# EAGLE design motherboard (EAGLE 7.2.0)
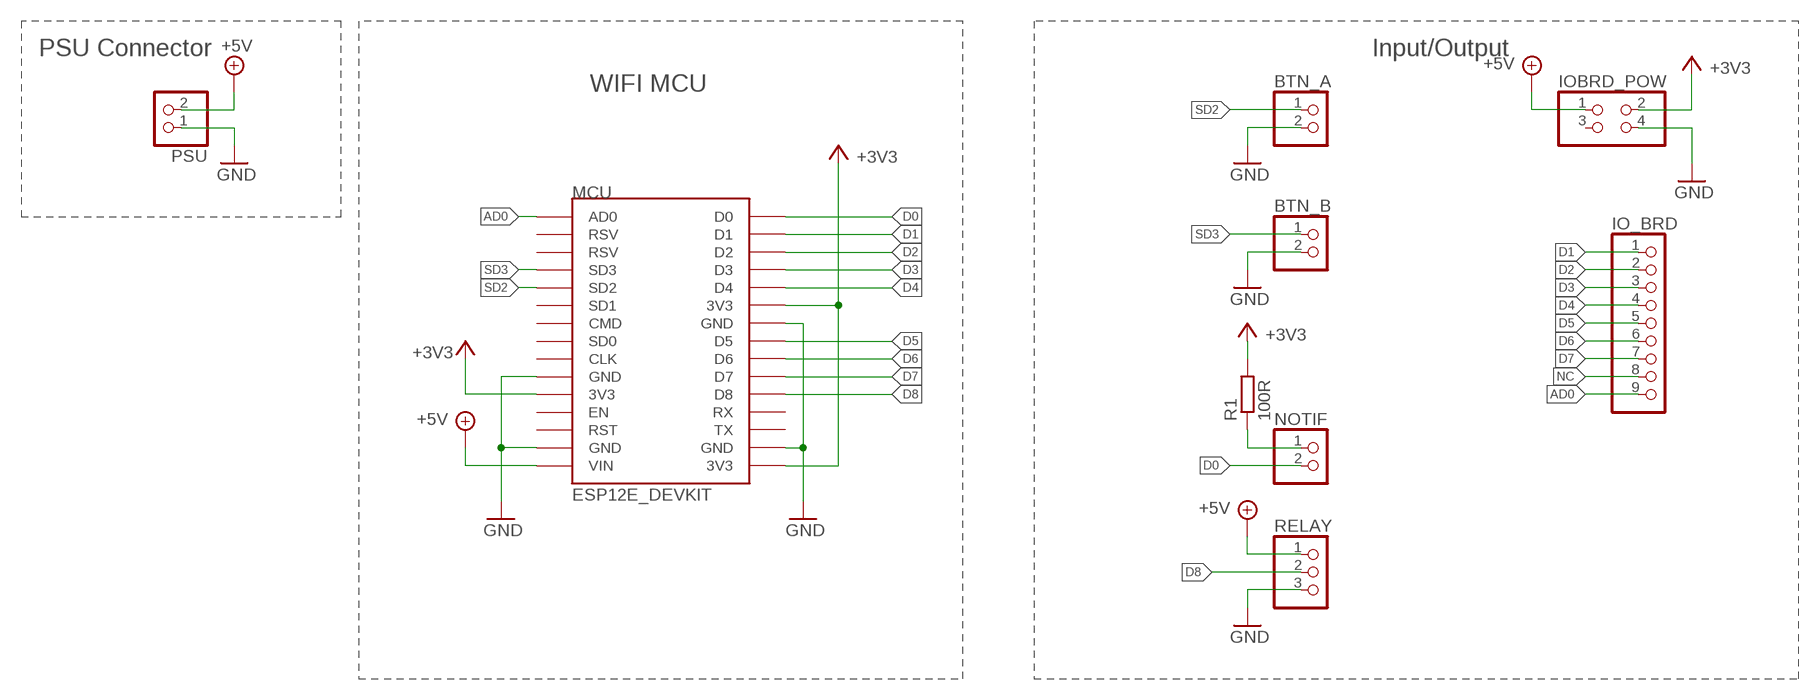
[diagram p0: schematic, sheet 1]

## Parts
BTN_A  PINHD-1X2  [1X02]
BTN_B  PINHD-1X2  [1X02]
IO_BRD  PINHD-1X9  [1X09]
IOBRD_POW  PINHD-2X2  [2X02]
MCU  ESP12E_DEVKIT  [ESP12E_DEVKIT]
NOTIF  PINHD-1X2  [1X02]
PSU  PINHD-1X2  [1X02]
R1  100R  R-EU_0204/7  [0204/7]
RELAY  PINHD-1X3  [1X03]

## Nets
+3V3: IOBRD_POW.2 MCU.3V3@0(3V3) MCU.3V3@1(3V3) MCU.3V3@2(3V3) R1.2
+5V: IOBRD_POW.1 MCU.VIN PSU.2 RELAY.1
AD0: IO_BRD.9 MCU.AD0
D0: MCU.D0 NOTIF.2
D1: IO_BRD.1 MCU.D1
D2: IO_BRD.2 MCU.D2
D3: IO_BRD.3 MCU.D3
D4: IO_BRD.4 MCU.D4
D5: IO_BRD.5 MCU.D5
D6: IO_BRD.6 MCU.D6
D7: IO_BRD.7 MCU.D7
D8: MCU.D8 RELAY.2
GND: BTN_A.2 BTN_B.2 IOBRD_POW.4 MCU.GND@0(GND) MCU.GND@1(GND) MCU.GND@2(GND) MCU.GND@3(GND) PSU.1 RELAY.3
N$1: NOTIF.1 R1.1
NC: IO_BRD.8
SD2: BTN_A.1 MCU.SD2
SD3: BTN_B.1 MCU.SD3
Unconnected: IOBRD_POW.3 MCU.CLK MCU.CMD MCU.EN MCU.RST MCU.RSV@0(RSV) MCU.RSV@1(RSV) MCU.RX MCU.SD0 MCU.SD1 MCU.TX

## Notes on the sheet
- PSU Connector | Input/Output
- WIFI MCU

## Library data of the parts
BTN_A BTN_B NOTIF PSU = pinhead:PINHD-1X2: PIN HEADER
IO_BRD = pinhead:PINHD-1X9: PIN HEADER
IOBRD_POW = pinhead:PINHD-2X2: PIN HEADER
MCU = ESP12E_DEVKIT:ESP12E_DEVKIT: ESP12E DEVKIT BOARD
R1 = rcl:R-EU_: RESISTOR, European symbol
RELAY = pinhead:PINHD-1X3: PIN HEADER

## Board
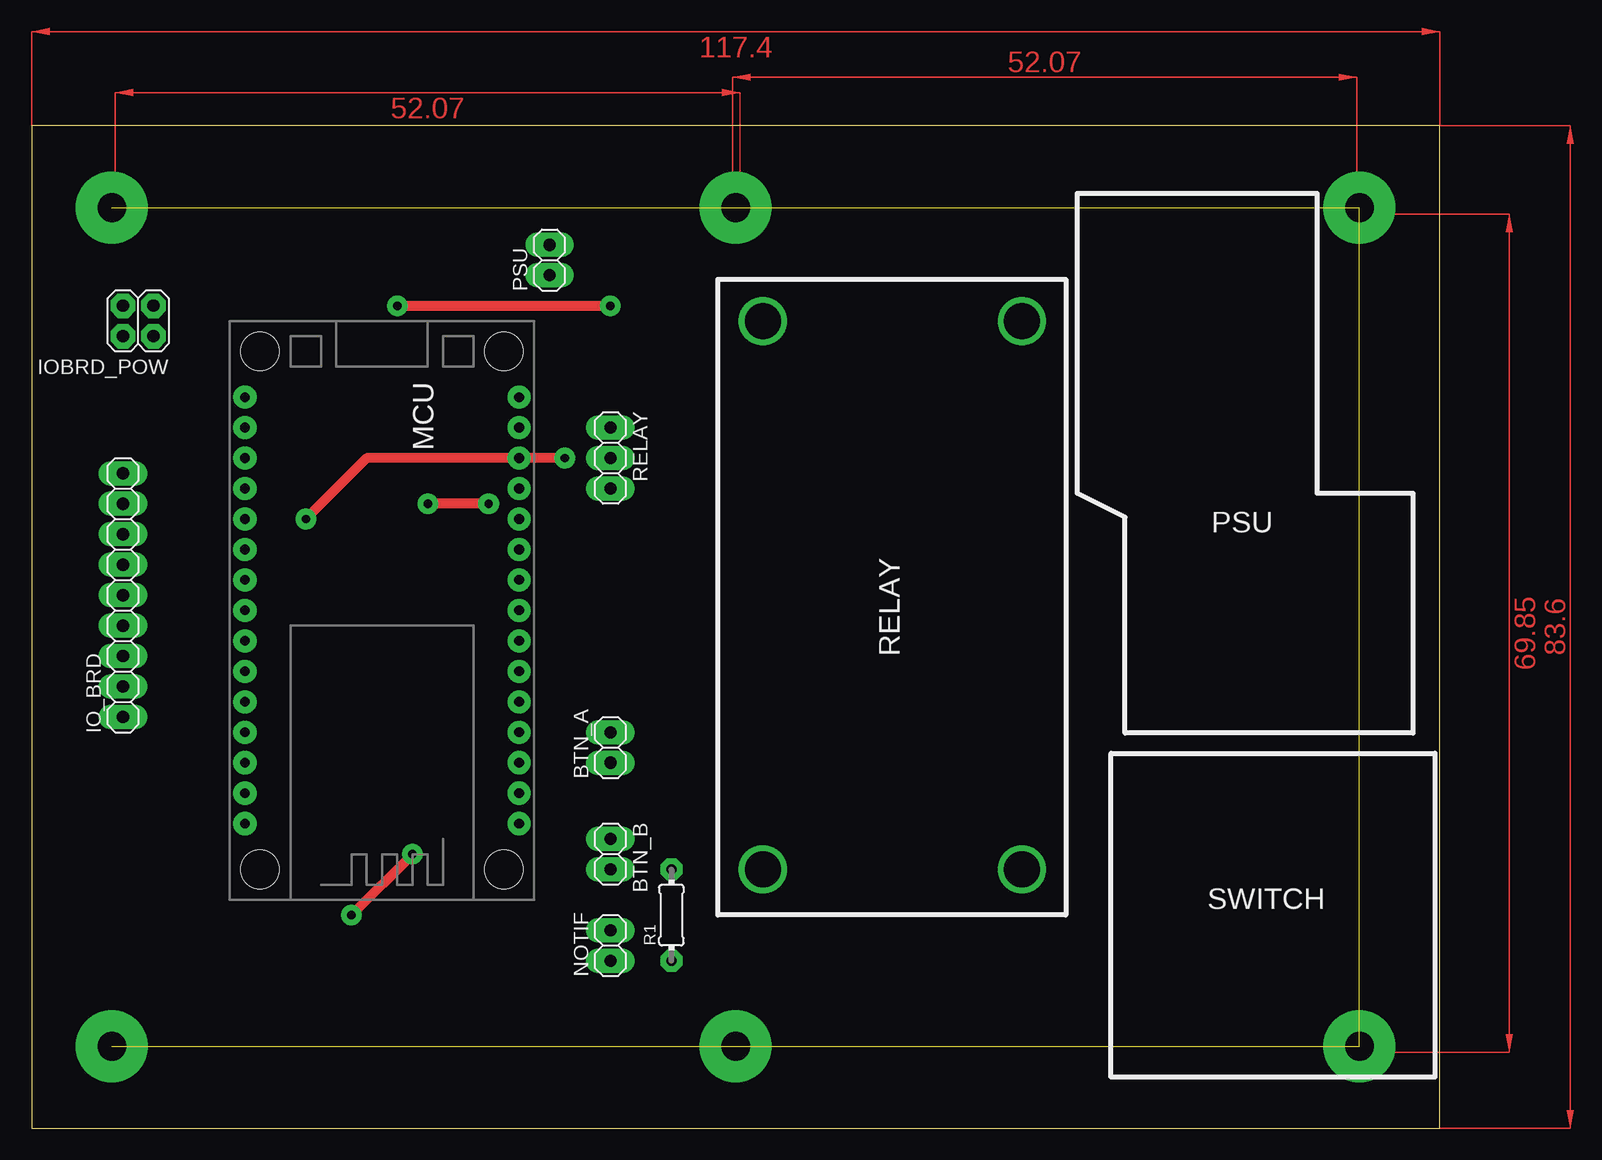
[diagram p1: board, top side]
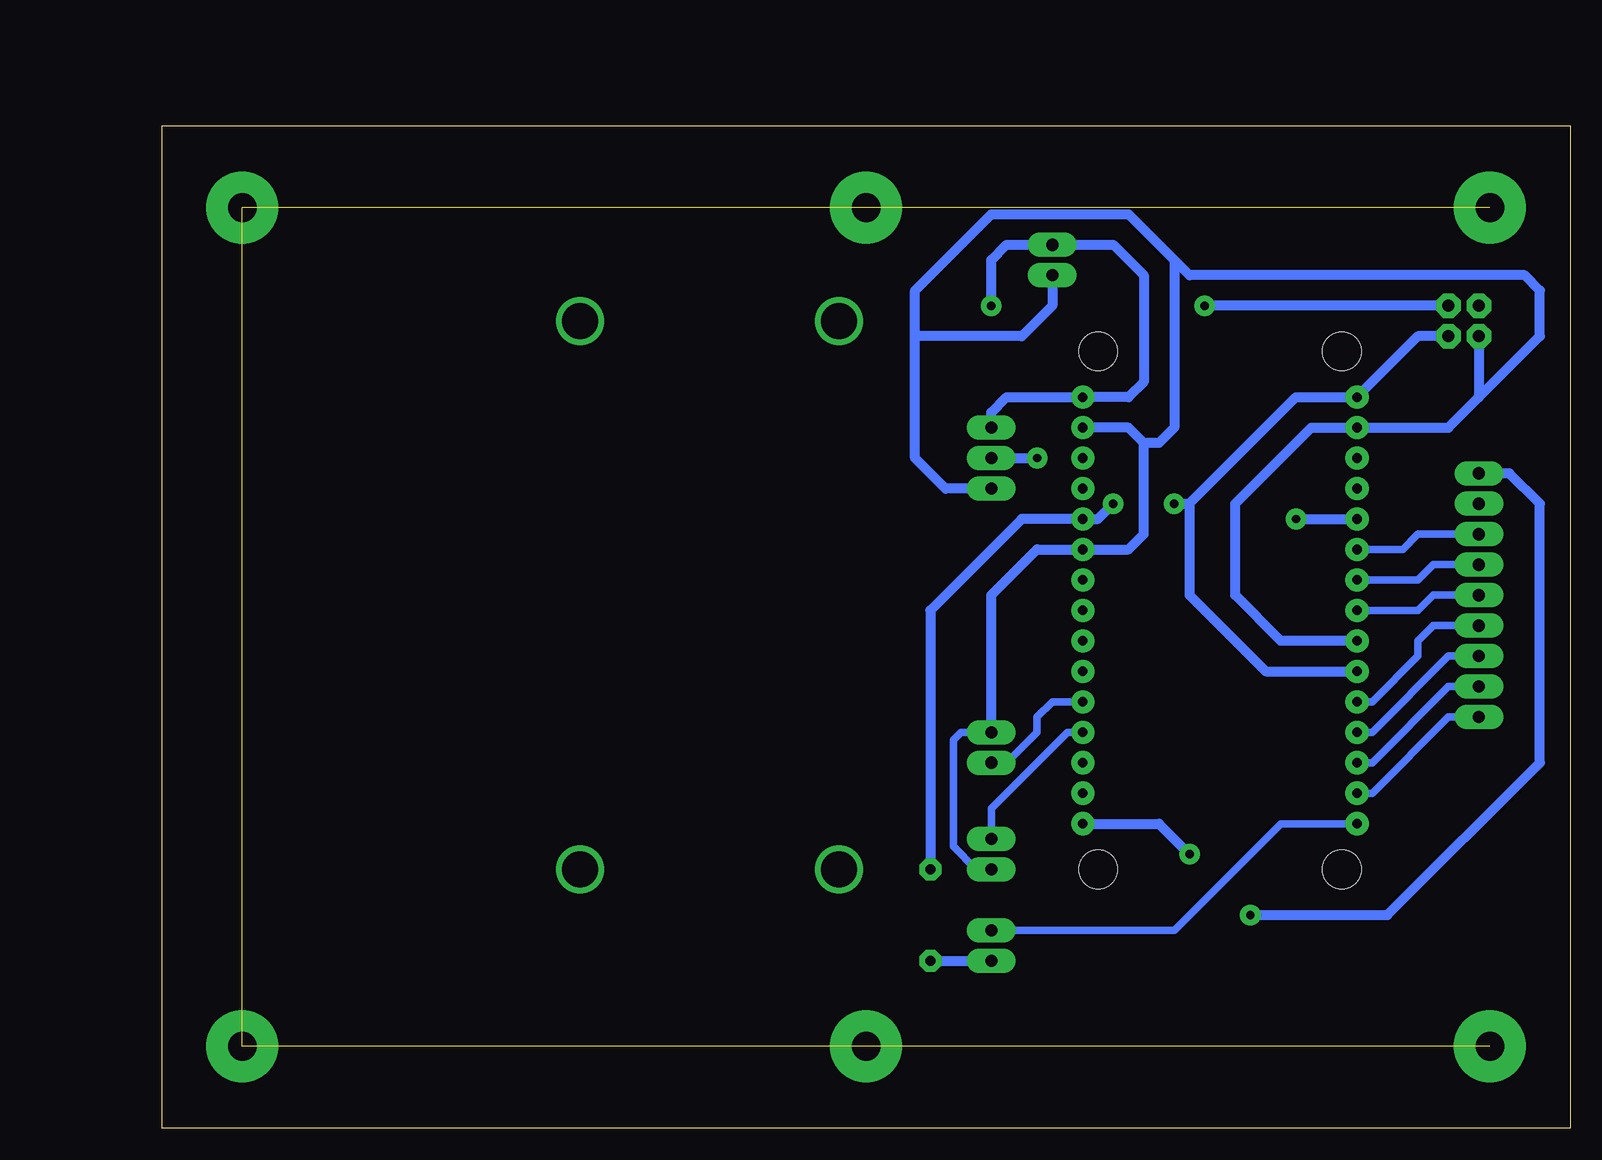
[diagram p2: board, bottom side, seen from below]

Size 117.4 x 83.6 mm. Coordinates in mm from the lower left corner, seen from the top.
Outline: 0,0 117.4,0 117.4,83.6 0,83.6 0,0
Copper layers (1*16): Top 0.035mm / dielectric 1.5mm / Bottom 0.035mm
Design rules "default *": minimum track width 10mil, minimum drill 24mil, track to track 8mil, track to pad 8mil, pad to pad 8mil, via to via 8mil, smd to smd 8mil, copper to edge 40mil, drill to drill 8mil, minimum pad ring 20mil, minimum via ring 20mil, stop-mask expansion 4mil, vias tented up to drill 0mil, thermal gap 10mil

### Footprints (pad centres in the part's own frame; a part is rotated, then mirrored left to right if it is on the bottom)
1X02 = drill 1.016 long: 1 -1.27,0; 2 1.27,0
1X09 = drill 1.016 long: 1 -10.16,0; 2 -7.62,0; 3 -5.08,0; 4 -2.54,0; 5 0,0; 6 2.54,0; 7 5.08,0; 8 7.62,0; 9 10.16,0
2X02 = drill 1.016 octagon: 1 -1.27,-1.27; 2 -1.27,1.27; 3 1.27,-1.27; 4 1.27,1.27
ESP12E_DEVKIT = drill 0.8 pad 1.93: 3V3@0 -11.43,-7.62; 3V3@1 11.43,5.08; 3V3@2 11.43,-17.78; AD0 -11.43,17.78; CLK -11.43,-2.54; CMD -11.43,2.54; D0 11.43,17.78; D1 11.43,15.24; D2 11.43,12.7; D3 11.43,10.16; D4 11.43,7.62; D5 11.43,0; D6 11.43,-2.54; D7 11.43,-5.08; D8 11.43,-7.62; EN -11.43,-10.16; GND@0 -11.43,-5.08; GND@1 -11.43,-15.24; GND@2 11.43,2.54; GND@3 11.43,-15.24; RST -11.43,-12.7; RSV@0 -11.43,15.24; RSV@1 -11.43,12.7; RX 11.43,-10.16; SD0 -11.43,0; SD1 -11.43,5.08; SD2 -11.43,7.62; SD3 -11.43,10.16; TX 11.43,-12.7; VIN -11.43,-17.78 | hole 3.2: -10.16,21.59; 10.16,21.59; 10.16,-21.59; -10.16,-21.59
0204/7 = drill 0.813 octagon: 1 -3.81,0; 2 3.81,0
1X03 = drill 1.016 long: 1 -2.54,0; 2 0,0; 3 2.54,0

### Placement (x,y rotation side)
BTN_A  48.26,31.75 90 top
BTN_B  48.26,22.86 270 top
IO_BRD  7.62,44.45 90 top
IOBRD_POW  8.89,67.31 180 top
MCU  29.21,43.18 180 top
NOTIF  48.26,15.24 90 top
PSU  43.18,72.39 90 top
R1  53.34,17.78 90 top
RELAY  48.26,55.88 270 top

### Tracks (layer width: path | path; a pad name or v marks a point on that pad's centre or on a via)
+3V3  (via drill 0.7)
  Top 0.813: v38.1,52.07 v33.02,52.07
  Bottom 0.813: IOBRD_POW.2 12.7,66.04 MCU.3V3@2 22.86,60.96 31.75,52.07 | v38.1,52.07 39.37,50.8 MCU.3V3@0 45.72,50.8 53.34,43.18 R1.2 | v33.02,52.07 31.75,52.07 | 31.75,52.07 31.75,44.45 25.4,38.1 MCU.3V3@1
+5V  (via drill 0.7)
  Top 0.813: v30.48,68.58 v48.26,68.58
  Bottom 0.813: RELAY.1 48.26,59.69 46.99,60.96 MCU.VIN 36.83,60.96 35.56,62.23 35.56,71.12 38.1,73.66 PSU.2 46.99,73.66 48.26,72.39 v48.26,68.58 | IOBRD_POW.1 v30.48,68.58
AD0  (via drill 0.7)
  Top 0.813: v31.75,22.86 v26.67,17.78
  Bottom 0.813: MCU.AD0 34.29,25.4 v31.75,22.86 | v26.67,17.78 15.24,17.78 2.54,30.48 2.54,52.07 5.08,54.61 IO_BRD.9
D0
  Bottom 0.61: NOTIF.2 33.02,16.51 24.13,25.4 MCU.D0
D1
  Bottom 0.61: MCU.D1 16.51,27.94 10.16,34.29 IO_BRD.1
D2
  Bottom 0.61: IO_BRD.2 10.16,36.83 16.51,30.48 MCU.D2
D3
  Bottom 0.61: MCU.D3 16.51,33.02 10.16,39.37 IO_BRD.3
D4
  Bottom 0.61: MCU.D4 16.51,35.56 12.7,39.37 12.7,40.64 11.43,41.91 IO_BRD.4
D5
  Bottom 0.61: MCU.D5 12.7,43.18 11.43,44.45 IO_BRD.5
D6
  Bottom 0.61: MCU.D6 12.7,45.72 11.43,46.99 IO_BRD.6
D7
  Bottom 0.61: MCU.D7 13.97,48.26 12.7,49.53 IO_BRD.7
D8  (via drill 0.7)
  Top 0.813: v44.45,55.88 27.94,55.88 v22.86,50.8
  Bottom 0.813: RELAY.2 v44.45,55.88 | v22.86,50.8 MCU.D8
GND
  Bottom 0.61: BTN_B.2 49.53,21.59 51.44,23.5 51.44,32.38 50.8,33.02 BTN_A.2
  Bottom 0.813: 35.56,57.15 35.56,49.53 36.83,48.26 MCU.GND@0 44.45,48.26 48.26,44.45 BTN_A.2 | 35.56,57.15 36.83,58.42 MCU.GND@1 | RELAY.3 52.07,53.34 54.61,55.88 54.61,66.04 | 54.61,66.04 54.61,69.85 48.26,76.2 36.83,76.2 33.02,72.39 | 33.02,72.39 33.02,58.42 34.29,57.15 35.56,57.15 | PSU.1 43.18,68.58 45.72,66.04 54.61,66.04 | IOBRD_POW.4 7.62,60.96 | 7.62,60.96 10.16,58.42 MCU.GND@3 21.59,58.42 27.94,52.07 27.94,44.45 24.13,40.64 MCU.GND@2 | 7.62,60.96 2.54,66.04 2.54,69.85 3.81,71.12 31.75,71.12 33.02,72.39
N$1
  Bottom 0.813: R1.1 NOTIF.1
N$2  (via drill 2.4 pad 6)  (5 unrouted)
  other vias: 6.7,76.75 110.7,6.85 6.7,6.85 110.7,76.75 58.7,76.75 58.7,6.85
N$3  (via drill 3)
  other vias: 60.96,67.31
N$4  (via drill 3)
  other vias: 82.55,67.31
N$5  (via drill 3)
  other vias: 82.55,21.59
N$6  (via drill 3)
  other vias: 60.96,21.59
SD2
  Bottom 0.61: BTN_A.1 46.99,30.48 44.45,33.02 44.45,34.29 43.18,35.56 MCU.SD2
SD3
  Bottom 0.61: BTN_B.1 48.26,26.67 41.91,33.02 MCU.SD3
(copper drawn outside any net)
  shapes: Top area x5

### Text on the board
tPlace: PSU | RELAY | SWITCH